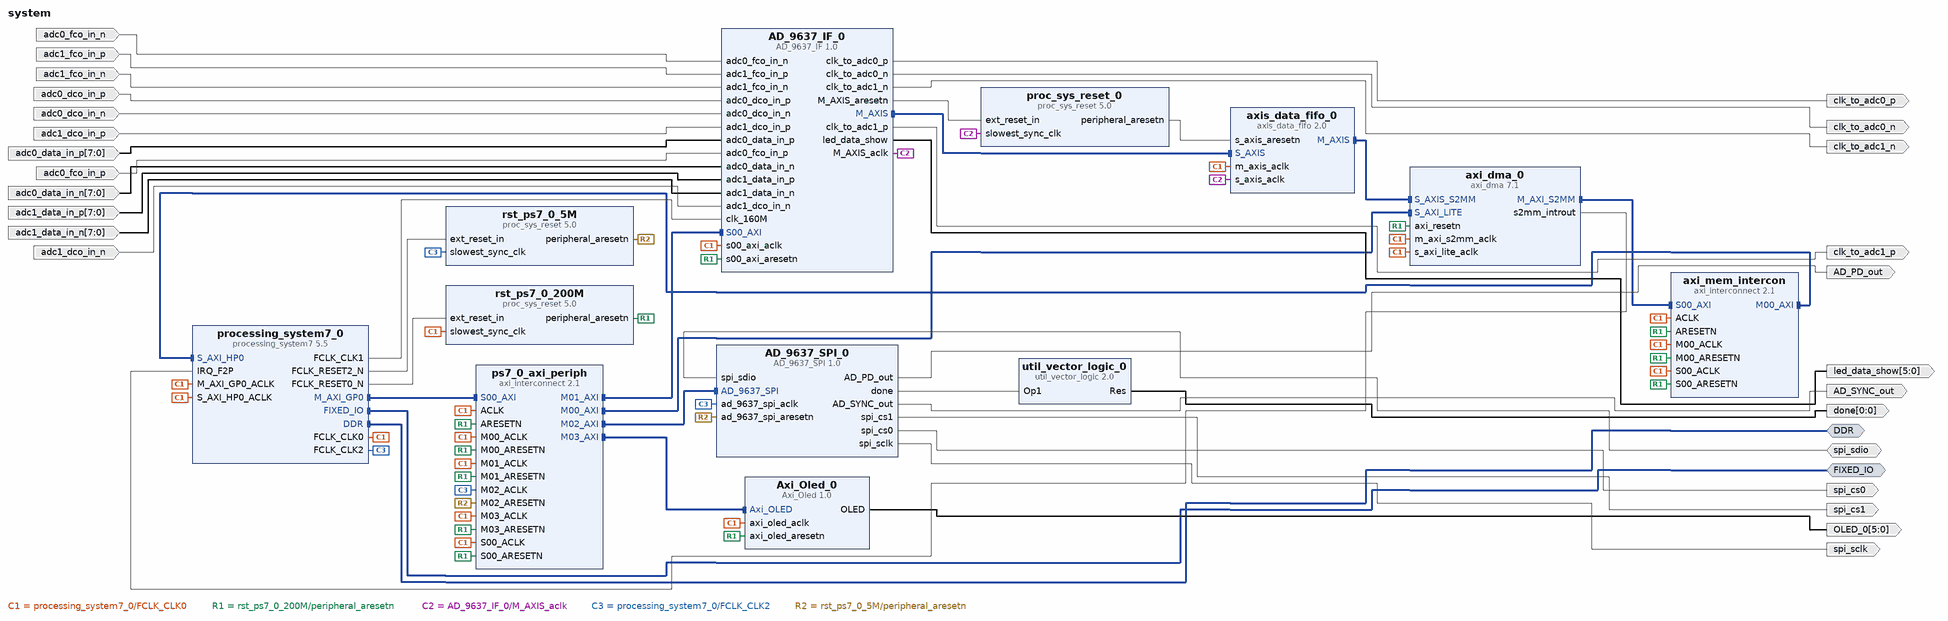
[diagram p0: block diagram of the top level]
# Vivado block design system, xc7z020clg484-1, Vivado 2019.1
create_bd_design system

create_bd_intf_port -mode Master -vlnv xilinx.com:interface:ddrx_rtl:1.0 DDR
create_bd_intf_port -mode Master -vlnv xilinx.com:display_processing_system7:fixedio_rtl:1.0 FIXED_IO
create_bd_port -dir I adc0_fco_in_n
create_bd_port -dir I adc1_fco_in_p
create_bd_port -dir I adc1_fco_in_n
create_bd_port -dir I adc0_dco_in_p
create_bd_port -dir I adc0_dco_in_n
create_bd_port -dir I adc1_dco_in_p
create_bd_port -dir I -from 7 -to 0 adc0_data_in_p
create_bd_port -dir I adc0_fco_in_p
create_bd_port -dir I -from 7 -to 0 adc0_data_in_n
create_bd_port -dir I -from 7 -to 0 adc1_data_in_p
create_bd_port -dir I -from 7 -to 0 adc1_data_in_n
create_bd_port -dir I adc1_dco_in_n
create_bd_port -dir O clk_to_adc0_p
create_bd_port -dir O clk_to_adc0_n
create_bd_port -dir O clk_to_adc1_p
create_bd_port -dir O clk_to_adc1_n
create_bd_port -dir O -from 5 -to 0 led_data_show
create_bd_port -dir O AD_PD_out
create_bd_port -dir O -from 0 -to 0 done
create_bd_port -dir O spi_cs1
create_bd_port -dir O spi_cs0
create_bd_port -dir IO spi_sdio
create_bd_port -dir O spi_sclk
create_bd_port -dir O AD_SYNC_out
create_bd_port -dir O -from 5 -to 0 OLED_0

create_bd_cell -type ip -vlnv xilinx.com:ip:processing_system7:5.5 processing_system7_0
set_property -dict [list \
  CONFIG.PCW_APU_PERIPHERAL_FREQMHZ 666.666667 \
  CONFIG.PCW_ENET0_ENET0_IO {MIO 16 .. 27} \
  CONFIG.PCW_ENET0_GRP_MDIO_ENABLE 1 \
  CONFIG.PCW_ENET0_GRP_MDIO_IO {MIO 52 .. 53} \
  CONFIG.PCW_ENET0_PERIPHERAL_ENABLE 1 \
  CONFIG.PCW_ENET0_RESET_ENABLE 0 \
  CONFIG.PCW_ENET1_PERIPHERAL_CLKSRC External \
  CONFIG.PCW_ENET_RESET_ENABLE 1 \
  CONFIG.PCW_ENET_RESET_SELECT {Share reset pin} \
  CONFIG.PCW_EN_CLK1_PORT 1 \
  CONFIG.PCW_EN_CLK2_PORT 1 \
  CONFIG.PCW_EN_RST2_PORT 1 \
  CONFIG.PCW_FCLK_CLK1_BUF TRUE \
  CONFIG.PCW_FCLK_CLK2_BUF TRUE \
  CONFIG.PCW_FPGA0_PERIPHERAL_FREQMHZ 200.000000 \
  CONFIG.PCW_FPGA1_PERIPHERAL_FREQMHZ 160.000000 \
  CONFIG.PCW_FPGA2_PERIPHERAL_FREQMHZ 5 \
  CONFIG.PCW_FPGA_FCLK1_ENABLE 1 \
  CONFIG.PCW_FPGA_FCLK2_ENABLE 1 \
  CONFIG.PCW_GPIO_MIO_GPIO_ENABLE 1 \
  CONFIG.PCW_GPIO_MIO_GPIO_IO MIO \
  CONFIG.PCW_I2C_RESET_ENABLE 0 \
  CONFIG.PCW_IRQ_F2P_INTR 1 \
  CONFIG.PCW_PRESET_BANK1_VOLTAGE {LVCMOS 1.8V} \
  CONFIG.PCW_QSPI_GRP_SINGLE_SS_ENABLE 1 \
  CONFIG.PCW_QSPI_GRP_SINGLE_SS_IO {MIO 1 .. 6} \
  CONFIG.PCW_QSPI_PERIPHERAL_ENABLE 1 \
  CONFIG.PCW_QSPI_QSPI_IO {MIO 1 .. 6} \
  CONFIG.PCW_SD0_PERIPHERAL_ENABLE 0 \
  CONFIG.PCW_SINGLE_QSPI_DATA_MODE x4 \
  CONFIG.PCW_UART1_PERIPHERAL_ENABLE 1 \
  CONFIG.PCW_UART1_UART1_IO {MIO 48 .. 49} \
  CONFIG.PCW_UART_PERIPHERAL_FREQMHZ 50 \
  CONFIG.PCW_UIPARAM_DDR_FREQ_MHZ 533.333313 \
  CONFIG.PCW_UIPARAM_DDR_PARTNO {MT41K128M16 JT-125} \
  CONFIG.PCW_USB0_PERIPHERAL_ENABLE 0 \
  CONFIG.PCW_USB_RESET_ENABLE 0 \
  CONFIG.PCW_USE_FABRIC_INTERRUPT 1 \
  CONFIG.PCW_USE_S_AXI_HP0 1 \
  CONFIG.preset ZedBoard \
] [get_bd_cells processing_system7_0]
# 226 more settings of processing_system7_0 are not shown: defaults, MIO pin electricals, DDR timing, and values the tool derives
create_bd_cell -type ip -vlnv xilinx.com:ip:axi_interconnect:2.1 ps7_0_axi_periph
set_property -dict {CONFIG.NUM_MI 4} [get_bd_cells ps7_0_axi_periph]
create_bd_cell -type ip -vlnv xilinx.com:ip:proc_sys_reset:5.0 rst_ps7_0_200M
create_bd_cell -type ip -vlnv xilinx.com:ip:util_vector_logic:2.0 util_vector_logic_0
set_property -dict {CONFIG.C_OPERATION not CONFIG.C_SIZE 1} [get_bd_cells util_vector_logic_0]
create_bd_cell -type ip -vlnv xilinx.com:ip:axis_data_fifo:2.0 axis_data_fifo_0
set_property -dict [list \
  CONFIG.HAS_TKEEP 0 \
  CONFIG.IS_ACLK_ASYNC 1 \
  CONFIG.SYNCHRONIZATION_STAGES 2 \
  CONFIG.TDATA_NUM_BYTES 4 \
] [get_bd_cells axis_data_fifo_0]
create_bd_cell -type ip -vlnv xilinx.com:ip:proc_sys_reset:5.0 proc_sys_reset_0
create_bd_cell -type ip -vlnv xilinx.com:ip:axi_dma:7.1 axi_dma_0
set_property -dict {CONFIG.c_include_mm2s 0 CONFIG.c_include_sg 0} [get_bd_cells axi_dma_0]
create_bd_cell -type ip -vlnv xilinx.com:ip:axi_interconnect:2.1 axi_mem_intercon
set_property -dict {CONFIG.NUM_MI 1} [get_bd_cells axi_mem_intercon]
create_bd_cell -type ip -vlnv xilinx.com:ip:proc_sys_reset:5.0 rst_ps7_0_5M
create_bd_cell -type ip -vlnv xilinx.com:user:Axi_Oled:1.0 Axi_Oled_0
create_bd_cell -type ip -vlnv xilinx.com:user:AD_9637_IF:1.0 AD_9637_IF_0
create_bd_cell -type ip -vlnv xilinx.com:user:AD_9637_SPI:1.0 AD_9637_SPI_0

# ---- connections ----

connect_bd_intf_net [get_bd_intf_pins ps7_0_axi_periph/M03_AXI] [get_bd_intf_pins Axi_Oled_0/Axi_OLED]
connect_bd_intf_net [get_bd_intf_pins ps7_0_axi_periph/M01_AXI] [get_bd_intf_pins AD_9637_IF_0/S00_AXI]
connect_bd_intf_net [get_bd_intf_pins axi_dma_0/M_AXI_S2MM] [get_bd_intf_pins axi_mem_intercon/S00_AXI]
connect_bd_intf_net [get_bd_intf_ports FIXED_IO] [get_bd_intf_pins processing_system7_0/FIXED_IO]
connect_bd_intf_net [get_bd_intf_pins axi_dma_0/S_AXI_LITE] [get_bd_intf_pins ps7_0_axi_periph/M00_AXI]
connect_bd_intf_net [get_bd_intf_pins axi_mem_intercon/M00_AXI] [get_bd_intf_pins processing_system7_0/S_AXI_HP0]
connect_bd_intf_net [get_bd_intf_pins AD_9637_IF_0/M_AXIS] [get_bd_intf_pins axis_data_fifo_0/S_AXIS]
connect_bd_intf_net [get_bd_intf_pins processing_system7_0/M_AXI_GP0] [get_bd_intf_pins ps7_0_axi_periph/S00_AXI]
connect_bd_intf_net [get_bd_intf_pins ps7_0_axi_periph/M02_AXI] [get_bd_intf_pins AD_9637_SPI_0/AD_9637_SPI]
connect_bd_intf_net [get_bd_intf_pins axis_data_fifo_0/M_AXIS] [get_bd_intf_pins axi_dma_0/S_AXIS_S2MM]
connect_bd_intf_net [get_bd_intf_ports DDR] [get_bd_intf_pins processing_system7_0/DDR]
connect_bd_net [get_bd_pins processing_system7_0/FCLK_CLK0] \
  [get_bd_pins ps7_0_axi_periph/ACLK] [get_bd_pins processing_system7_0/M_AXI_GP0_ACLK] \
  [get_bd_pins ps7_0_axi_periph/S00_ACLK] [get_bd_pins rst_ps7_0_200M/slowest_sync_clk] \
  [get_bd_pins ps7_0_axi_periph/M00_ACLK] [get_bd_pins ps7_0_axi_periph/M01_ACLK] [get_bd_pins axis_data_fifo_0/m_axis_aclk] \
  [get_bd_pins axi_dma_0/s_axi_lite_aclk] [get_bd_pins axi_mem_intercon/ACLK] [get_bd_pins axi_dma_0/m_axi_s2mm_aclk] \
  [get_bd_pins axi_mem_intercon/S00_ACLK] [get_bd_pins processing_system7_0/S_AXI_HP0_ACLK] \
  [get_bd_pins axi_mem_intercon/M00_ACLK] [get_bd_pins Axi_Oled_0/axi_oled_aclk] [get_bd_pins ps7_0_axi_periph/M03_ACLK] \
  [get_bd_pins AD_9637_IF_0/s00_axi_aclk]
connect_bd_net [get_bd_pins processing_system7_0/FCLK_RESET0_N] [get_bd_pins rst_ps7_0_200M/ext_reset_in]
connect_bd_net [get_bd_pins rst_ps7_0_200M/peripheral_aresetn] \
  [get_bd_pins ps7_0_axi_periph/S00_ARESETN] [get_bd_pins ps7_0_axi_periph/M00_ARESETN] \
  [get_bd_pins ps7_0_axi_periph/ARESETN] [get_bd_pins ps7_0_axi_periph/M01_ARESETN] [get_bd_pins axi_dma_0/axi_resetn] \
  [get_bd_pins axi_mem_intercon/S00_ARESETN] [get_bd_pins axi_mem_intercon/M00_ARESETN] \
  [get_bd_pins axi_mem_intercon/ARESETN] [get_bd_pins Axi_Oled_0/axi_oled_aresetn] [get_bd_pins ps7_0_axi_periph/M03_ARESETN] \
  [get_bd_pins AD_9637_IF_0/s00_axi_aresetn]
connect_bd_net [get_bd_pins processing_system7_0/FCLK_CLK1] [get_bd_pins AD_9637_IF_0/clk_160M]
connect_bd_net -net adc0_fco_in_n_0_1 [get_bd_ports adc0_fco_in_n] [get_bd_pins AD_9637_IF_0/adc0_fco_in_n]
connect_bd_net -net adc1_fco_in_p_0_1 [get_bd_ports adc1_fco_in_p] [get_bd_pins AD_9637_IF_0/adc1_fco_in_p]
connect_bd_net -net adc1_fco_in_n_0_1 [get_bd_ports adc1_fco_in_n] [get_bd_pins AD_9637_IF_0/adc1_fco_in_n]
connect_bd_net -net adc0_dco_in_p_0_1 [get_bd_ports adc0_dco_in_p] [get_bd_pins AD_9637_IF_0/adc0_dco_in_p]
connect_bd_net -net adc0_dco_in_n_0_1 [get_bd_ports adc0_dco_in_n] [get_bd_pins AD_9637_IF_0/adc0_dco_in_n]
connect_bd_net -net adc1_dco_in_p_0_1 [get_bd_ports adc1_dco_in_p] [get_bd_pins AD_9637_IF_0/adc1_dco_in_p]
connect_bd_net -net adc0_data_in_p_0_1 [get_bd_ports adc0_data_in_p] [get_bd_pins AD_9637_IF_0/adc0_data_in_p]
connect_bd_net -net adc0_fco_in_p_0_1 [get_bd_ports adc0_fco_in_p] [get_bd_pins AD_9637_IF_0/adc0_fco_in_p]
connect_bd_net -net adc0_data_in_n_0_1 [get_bd_ports adc0_data_in_n] [get_bd_pins AD_9637_IF_0/adc0_data_in_n]
connect_bd_net -net adc1_data_in_p_0_1 [get_bd_ports adc1_data_in_p] [get_bd_pins AD_9637_IF_0/adc1_data_in_p]
connect_bd_net -net adc1_data_in_n_0_1 [get_bd_ports adc1_data_in_n] [get_bd_pins AD_9637_IF_0/adc1_data_in_n]
connect_bd_net -net adc1_dco_in_n_0_1 [get_bd_ports adc1_dco_in_n] [get_bd_pins AD_9637_IF_0/adc1_dco_in_n]
connect_bd_net [get_bd_pins AD_9637_IF_0/clk_to_adc0_p] [get_bd_ports clk_to_adc0_p]
connect_bd_net [get_bd_pins AD_9637_IF_0/clk_to_adc0_n] [get_bd_ports clk_to_adc0_n]
connect_bd_net [get_bd_pins AD_9637_IF_0/clk_to_adc1_p] [get_bd_ports clk_to_adc1_p]
connect_bd_net [get_bd_pins AD_9637_IF_0/clk_to_adc1_n] [get_bd_ports clk_to_adc1_n]
connect_bd_net [get_bd_pins AD_9637_IF_0/led_data_show] [get_bd_ports led_data_show]
connect_bd_net [get_bd_pins AD_9637_SPI_0/AD_PD_out] [get_bd_ports AD_PD_out]
connect_bd_net [get_bd_pins AD_9637_SPI_0/spi_cs1] [get_bd_ports spi_cs1]
connect_bd_net [get_bd_pins AD_9637_SPI_0/spi_cs0] [get_bd_ports spi_cs0]
connect_bd_net [get_bd_ports spi_sdio] [get_bd_pins AD_9637_SPI_0/spi_sdio]
connect_bd_net [get_bd_pins AD_9637_SPI_0/spi_sclk] [get_bd_ports spi_sclk]
connect_bd_net [get_bd_pins AD_9637_SPI_0/AD_SYNC_out] [get_bd_ports AD_SYNC_out]
connect_bd_net [get_bd_pins AD_9637_SPI_0/done] [get_bd_pins util_vector_logic_0/Op1]
connect_bd_net [get_bd_pins util_vector_logic_0/Res] [get_bd_ports done]
connect_bd_net [get_bd_pins AD_9637_IF_0/M_AXIS_aclk] [get_bd_pins axis_data_fifo_0/s_axis_aclk] [get_bd_pins proc_sys_reset_0/slowest_sync_clk]
connect_bd_net [get_bd_pins proc_sys_reset_0/peripheral_aresetn] [get_bd_pins axis_data_fifo_0/s_axis_aresetn]
connect_bd_net [get_bd_pins AD_9637_IF_0/M_AXIS_aresetn] [get_bd_pins proc_sys_reset_0/ext_reset_in]
connect_bd_net [get_bd_pins axi_dma_0/s2mm_introut] [get_bd_pins processing_system7_0/IRQ_F2P]
connect_bd_net [get_bd_pins processing_system7_0/FCLK_CLK2] \
  [get_bd_pins ps7_0_axi_periph/M02_ACLK] [get_bd_pins rst_ps7_0_5M/slowest_sync_clk] \
  [get_bd_pins AD_9637_SPI_0/ad_9637_spi_aclk]
connect_bd_net [get_bd_pins processing_system7_0/FCLK_RESET2_N] [get_bd_pins rst_ps7_0_5M/ext_reset_in]
connect_bd_net [get_bd_pins rst_ps7_0_5M/peripheral_aresetn] \
  [get_bd_pins ps7_0_axi_periph/M02_ARESETN] [get_bd_pins AD_9637_SPI_0/ad_9637_spi_aresetn]
connect_bd_net [get_bd_pins Axi_Oled_0/OLED] [get_bd_ports OLED_0]

# ---- address map ----
assign_bd_address -offset 0x00000000 -range 512M -target_address_space [get_bd_addr_spaces axi_dma_0/Data_S2MM] [get_bd_addr_segs processing_system7_0/S_AXI_HP0/HP0_DDR_LOWOCM]
assign_bd_address -offset 0x40400000 -range 64K -target_address_space [get_bd_addr_spaces processing_system7_0/Data] [get_bd_addr_segs axi_dma_0/S_AXI_LITE/Reg]
assign_bd_address -offset 0x43C00000 -range 64K -target_address_space [get_bd_addr_spaces processing_system7_0/Data] [get_bd_addr_segs AD_9637_SPI_0/AD_9637_SPI/AD_9637_SPI_reg]
assign_bd_address -offset 0x43C10000 -range 64K -target_address_space [get_bd_addr_spaces processing_system7_0/Data] [get_bd_addr_segs AD_9637_IF_0/S00_AXI/S00_AXI_reg]
assign_bd_address -offset 0x43C20000 -range 64K -target_address_space [get_bd_addr_spaces processing_system7_0/Data] [get_bd_addr_segs Axi_Oled_0/Axi_OLED/Axi_OLED_reg]

validate_bd_design
save_bd_design
